# Altium schematic sheet 2.Main_V2.4.SchDoc
size 431 x 304 mm
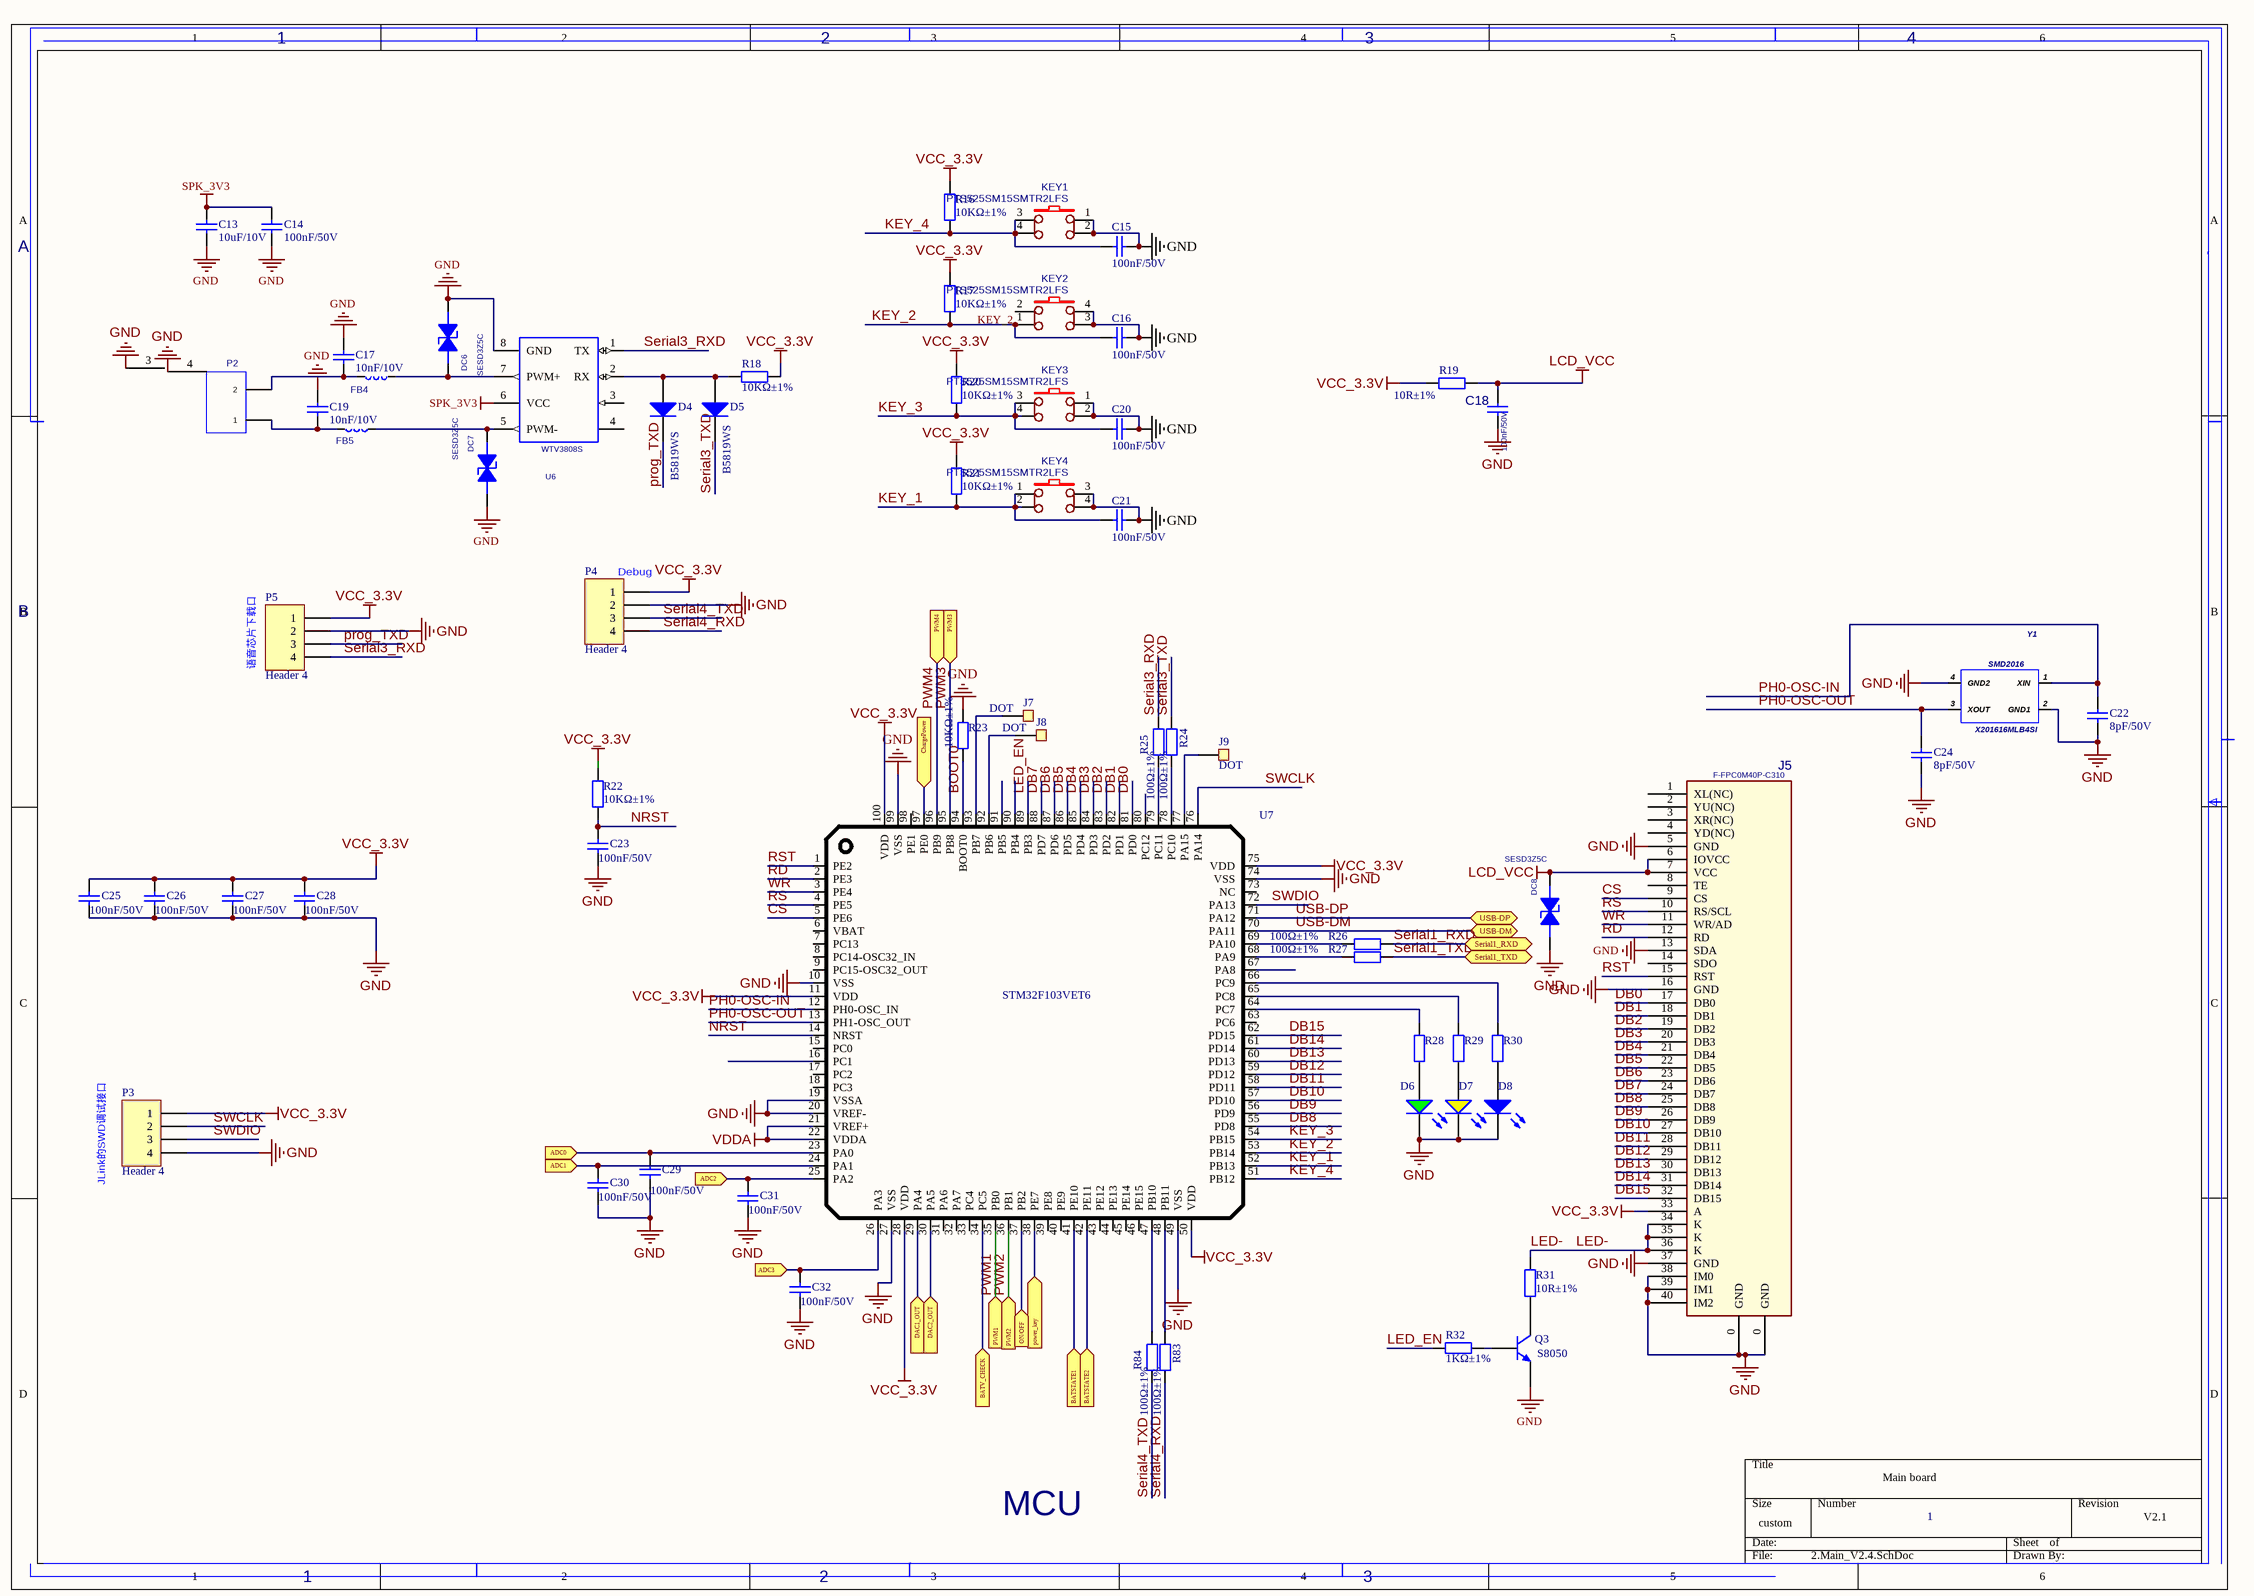
[diagram p0: 2.Main_V2.4.SchDoc]

## Parts
C13  10uF/10V  [0603C]
C14  100nF/50V  [0603C]
C15  100nF/50V  [0603C]
C16  100nF/50V  [0603C]
C17  10nF/10V  [0603C]
C18  100nF/50V  [0603C]
C19  10nF/10V  [0603C]
C20  100nF/50V  [0603C]
C21  100nF/50V  [0603C]
C22  8pF/50V  [0603C]
C23  100nF/50V  [0603C]
C24  8pF/50V  [0603C]
C25  100nF/50V  [0603C]
C26  100nF/50V  [0603C]
C27  100nF/50V  [0603C]
C28  100nF/50V  [0603C]
C29  100nF/50V  [0603C]
C30  100nF/50V  [0603C]
C31  100nF/50V  [0603C]
C32  100nF/50V  [0603C]
D4  B5819WS  [SOD-323]
D5  B5819WS  [SOD-323]
D6  19-217/GHC-YR1S2/3T  [0603_LED_S1]  (value not drawn)
D7  19-213/Y2C-CQ2R2L/3T(CY)  [0603_LED_S1]  (value not drawn)
D8  19-217/GHC-YR1S2/3T  [0603_LED_S1]  (value not drawn)
DC6  SESD3Z5C  [SOD323]
DC7  SESD3Z5C  [SOD323]
DC8  SESD3Z5C  [SOD323]
FB4  BLM18AG601SN1D  [R0603]  (value not drawn)
FB5  BLM18AG601SN1D  [R0603]  (value not drawn)
J5  F-FPC0M40P-C310  [FPC0.5 2H-WS-40P]
J7  DOT  [TP100MH]
J8  DOT  [TP100MH]
J9  DOT  [TP100MH]
KEY1  PTS525SM15SMTR2LFS  [KEY_KSC221JLFS]
KEY2  PTS525SM15SMTR2LFS  [KEY_KSC221JLFS]
KEY3  PTS525SM15SMTR2LFS  [KEY_KSC221JLFS]
KEY4  PTS525SM15SMTR2LFS  [KEY_KSC221JLFS]
P2  HX 1.25-2P WT  [1.25-2P]  (value not drawn)
P3  Header 4  [HDR1X4]
P4  Header 4  [HDR1X4]
P5  Header 4  [HDR1X4]
Q3  S8050  [SOT-23]
R16  10KΩ±1%  [0603R]
R17  10KΩ±1%  [0603R]
R18  10KΩ±1%  [0603R]
R19  10R±1%  [0603R]
R20  10KΩ±1%  [0603R]
R21  10KΩ±1%  [0603R]
R22  10KΩ±1%  [0603R]
R23  10KΩ±1%  [0603R]
R24  100Ω±1%  [0603R]
R25  100Ω±1%  [0603R]
R26  100Ω±1%  [0603R]
R27  100Ω±1%  [0603R]
R28  1.5KΩ±1%  [0603R]  (value not drawn)
R29  1.5KΩ±1%  [0603R]  (value not drawn)
R30  1.5KΩ±1%  [0603R]  (value not drawn)
R31  10R±1%  [0805_R]
R32  1KΩ±1%  [0603R]
R83  100Ω±1%  [0603R]
R84  100Ω±1%  [0603R]
U6  WTV3808S  [SOP-8_150mil]
U7  STM32F103VET6  [LQFP-100_14x14x05P]
Y1  X201616MLB4SI  PCB DECAL: SMD2016  [SMD_2016]

## Ports
ADC0 (in), ADC1 (in), ADC2 (in), ADC3 (in), BATSTATE1 (in), BATSTATE2 (in), BATV_CHECK (in), ChargePower (in), DAC1_OUT (in), DAC2_OUT (in), ON/OFF (in), power_key (in), PWM1 (in), PWM2 (in), PWM3 (in), PWM4 (in), Serial1_RXD (bidir), Serial1_TXD (bidir), USB-DM (bidir), USB-DP (bidir)

## Nets
GND: C13.2 C14.1 C15.1 C16.1 C17.1 C18.2 C19.1 C20.1 C21.1 C22.1 C23.1 C24.1 C25.1 C26.1 C27.1 C28.1 C29.1 C30.1 C31.1 C32.1 D6.K D7.K D8.K DC6.1(ANODE) DC7.1(ANODE) DC8.1(ANODE) J5.0(GND) J5.5(GND) J5.13(SDA) J5.16(GND) J5.37(GND) J5.38(IM0) J5.39(IM1) J5.40(IM2) KEY1.1 KEY1.2 KEY2.3 KEY2.4 KEY3.1 KEY3.2 KEY4.3 KEY4.4 P2.3 P2.4 P3.4 P4.2 P5.2 Q3.2(E) R23.1 U6.8(GND) U7.10(VSS) U7.19(VSSA) U7.20(VREF-) U7.27(VSS) U7.49(VSS) U7.74(VSS) U7.99(VSS) Y1.2(GND1) Y1.4(GND2)
LCD_VCC: C18.1 DC8.2(CATHODE) J5.6(IOVCC) J5.7(VCC) R19.1
SPK_3V3: C13.1 C14.2 U6.6(VCC)
VCC_3.3V: C25.2 C26.2 C27.2 C28.2 J5.33(A) P3.1 P4.1 P5.1 R16.2 R17.2 R18.1 R19.2 R20.2 R21.2 R22.2 U7.11(VDD) U7.28(VDD) U7.50(VDD) U7.75(VDD) U7.100(VDD)
VDDA: U7.21(VREF+) U7.22(VDDA)
ADC0: C29.2 U7.23(PA0) ; port ADC0
ADC1: C30.2 U7.24(PA1) ; port ADC1
ADC2: C31.2 U7.25(PA2) ; port ADC2
ADC3: C32.2 U7.26(PA3) ; port ADC3
BATSTATE1: U7.41(PE10) ; port BATSTATE1
BATSTATE2: U7.42(PE11) ; port BATSTATE2
BATV_CHECK: U7.34(PC5) ; port BATV_CHECK
BOOT0: R23.2 U7.94(BOOT0)
ChargePower: U7.97(PE0) ; port ChargePower
CS: J5.9(CS) U7.5(PE6)
DAC1_OUT: U7.29(PA4) ; port DAC1_OUT
DAC2_OUT: U7.30(PA5) ; port DAC2_OUT
DB0: J5.17(DB0) U7.81(PD0)
DB1: J5.18(DB1) U7.82(PD1)
DB2: J5.19(DB2) U7.83(PD2)
DB3: J5.20(DB3) U7.84(PD3)
DB4: J5.21(DB4) U7.85(PD4)
DB5: J5.22(DB5) U7.86(PD5)
DB6: J5.23(DB6) U7.87(PD6)
DB7: J5.24(DB7) U7.88(PD7)
DB8: J5.25(DB8) U7.55(PD8)
DB9: J5.26(DB9) U7.56(PD9)
DB10: J5.27(DB10) U7.57(PD10)
DB11: J5.28(DB11) U7.58(PD11)
DB12: J5.29(DB12) U7.59(PD12)
DB13: J5.30(DB13) U7.60(PD13)
DB14: J5.31(DB14) U7.61(PD14)
DB15: J5.32(DB15) U7.62(PD15)
KEY_1: C21.2 KEY4.1 KEY4.2 R21.1 U7.52(PB13)
KEY_2: C16.2 KEY2.1 KEY2.2 R17.1 U7.53(PB14)
KEY_3: C20.2 KEY3.3 KEY3.4 R20.1 U7.54(PB15)
KEY_4: C15.2 KEY1.3 KEY1.4 R16.1 U7.51(PB12)
LED-: J5.34(K) J5.35(K) J5.36(K) R31.2
LED_EN: R32.2 U7.89(PB3)
NRST: C23.2 R22.1 U7.14(NRST)
ON/OFF: U7.37(PB2) ; port ON/OFF
PH0-OSC-IN: C22.2 U7.12(PH0-OSC_IN) Y1.1(XIN)
PH0-OSC-OUT: C24.2 U7.13(PH1-OSC_OUT) Y1.3(XOUT)
power_key: U7.38(PE7) ; port power_key
prog_TXD: D4.2(K) P5.3
PWM1: U7.35(PB0) ; port PWM1
PWM2: U7.36(PB1) ; port PWM2
PWM3: U7.95(PB8) ; port PWM3
PWM4: U7.96(PB9) ; port PWM4
RD: J5.12(RD) U7.2(PE3)
RS: J5.10(RS/SCL) U7.4(PE5)
RST: J5.15(RST) U7.1(PE2)
Serial1_RXD: R26.1 ; port Serial1_RXD
Serial1_TXD: R27.1 ; port Serial1_TXD
Serial3_RXD: P5.4 R25.1 U6.1(TX)
Serial3_TXD: D5.2(K) R24.1
Serial4_RXD: P4.4 R83.2
Serial4_TXD: P4.3 R84.2
SWCLK: P3.2 U7.76(PA14)
SWDIO: P3.3 U7.72(PA13)
USB-DM: U7.70(PA11) ; port USB-DM
USB-DP: U7.71(PA12) ; port USB-DP
WR: J5.11(WR/AD) U7.3(PE4)
NetC17_2: C17.2 FB4.1 P2.2
NetC19_2: C19.2 FB5.1 P2.1
NetD4_1: D4.1(A) D5.1(A) R18.2 U6.2(RX)
NetD6_A: D6.A R28.1
NetD7_A: D7.A R29.1
NetD8_A: D8.A R30.1
NetDC6_2: DC6.2(CATHODE) FB4.2 U6.7(PWM+)
NetDC7_2: DC7.2(CATHODE) FB5.2 U6.5(PWM-)
NetJ7_1: J7.1 U7.93(PB7)
NetJ8_1: J8.1 U7.92(PB6)
NetJ9_1: J9.1 U7.77(PA15)
NetQ3_1: Q3.1(B) R32.1
NetQ3_3: Q3.3(C) R31.1
NetR24_2: R24.2 U7.78(PC10)
NetR25_2: R25.2 U7.79(PC11)
NetR26_2: R26.2 U7.69(PA10)
NetR27_2: R27.2 U7.68(PA9)
NetR28_2: R28.2 U7.64(PC7)
NetR29_2: R29.2 U7.65(PC8)
NetR30_2: R30.2 U7.66(PC9)
NetR83_1: R83.1 U7.48(PB11)
NetR84_1: R84.1 U7.47(PB10)

Not connected (* = marked no-connect by the designer): J5 1(XL(NC)) 2(YU(NC)) 3(XR(NC)) 4(YD(NC)) 8(TE) 14(SDO); U6 3(IN+) 4(IN-); U7 6(VBAT) 7(PC13) 8(PC14-OSC32_IN) 9(PC15-OSC32_OUT) 15(PC0) 16(PC1) 17(PC2) 18(PC3) 31(PA6) 32(PA7) 33(PC4) 39(PE8) 40(PE9) 43(PE12) 44(PE13) 45(PE14) 46(PE15) 63(PC6) 67(PA8) 73(NC) 80(PC12) 90(PB4) 91(PB5) 98(PE1)

## Notes on the sheet
- 1
- 2
- 3
- 4
- A
- (near P4) Debug
- B
- (near P5) 语音芯片下载口
- JLink的SWD调试接口
- Main board
- MCU
- V2.1

## Library data of the parts
C13 = Cap: Capacitor; Value: 100pF; Published: 8-Jun-2000; LatestRevisionDate: 17-Jul-2002; LatestRevisionNote: Re-released for DXP Platform.; PackageReference: RAD-0.3; Publisher: Altium Limited; PackageDescription: Radial Cap, Thru-Hole; 2 Leads; 0.3 in Pin Spacing
C14 = Cap: Capacitor 100nF/50V; Value: 100pF; Published: 8-Jun-2000; LatestRevisionDate: 17-Jul-2002; LatestRevisionNote: Re-released for DXP Platform.; PackageReference: RAD-0.3; Publisher: Altium Limited; PackageDescription: Radial Cap, Thru-Hole; 2 Leads; 0.3 in Pin Spacing
C15 C16 C20 C21 C23 C25-C32 = 0402 100nF (104) 10% 16V: 贴片电容100nF 10% 50V; ComponentLink1Description: 供应商链接; ComponentLink1URL: http://www.szlcsc.com/product/details_1877.html; Package: 0402; Supplier: LC; SuppliersPartNumber: C1525
C17 C19 = 0402 10nF (103) 10% 50V: 贴片电容; ComponentLink1Description: 供应商链接; ComponentLink1URL: http://www.szlcsc.com/product/details_15869.html; Package: 0402; Supplier: LC; SuppliersPartNumber: C15195
C18 = CAP103: PCB DECAL: C0603AA; Value: 0.1uF
C22 C24 = 0402 6.8pF (6R8) 0.25pF 50V: 贴片电容; ComponentLink1Description: 供应商链接; ComponentLink1URL: http://www.szlcsc.com/product/details_1928.html; Package: 0402; Supplier: LC; SuppliersPartNumber: C1576
D4 D5 = Diode: CJ(江苏长电/长晶); Published: 8-Jun-2000; LatestRevisionDate: 17-Jul-2002; LatestRevisionNote: Re-released for DXP Platform.; PackageVersion: Sep-1996; PackageReference: SMC; Publisher: Altium Limited; PackageDescription: DO-214-AB/SMC; 2 C-Bend Leads; Body 7.9 x 5.9 mm, inc. leads (LxW); Code_JEDEC: DO-214-AB
D6 = 0603 绿灯: 发光二极管 EVERLIGHT(亿光) 0603 翠绿; ComponentLink1Description: 供应商链接; ComponentLink1URL: http://www.szlcsc.com/product/details_73152.html; Package: 0603; Supplier: LC; SuppliersPartNumber: C72043
D7 = 0603 黄灯: 发光二极管  0603 黄灯; ComponentLink1Description: 供应商链接; ComponentLink1URL: http://www.szlcsc.com/product/details_73147.html; Package: 0603; Supplier: LC; SuppliersPartNumber: C72038
D8 = 0603 蓝灯: 发光二极管 EVERLIGHT(亿光) 0603 蓝灯; ComponentLink1Description: 供应商链接; ComponentLink1URL: http://www.szlcsc.com/product/details_73150.html; Package: 0603; Supplier: LC; SuppliersPartNumber: C72041
DC6-DC8 = ESD5451X_Dup1: ID: DE-E0004; Parameter: ESD0402
FB4 FB5 = ZXC: 磁珠/600Ω@100MHz ±25% BLM18AG601SN1D 0603; Value: 200R/1A; PCB DECAL: R0603
J5 = FPC_40_LVDS: ROOM: MIPI
KEY1-KEY4 = button6*6*8.5: BOM_Manufacturer: ReliaPro; BOM_Supplier Part: C59980; BOM_Supplier: LCSC; BOM_Manufacturer Part: button6*6*8.5; image: http://image.lceda.cn/szlcsc/C59980.jpg; spicePre: K; spiceSymbolName: button6*6*8.5
P2 = DIP-2.0-2P: SHOU HAN(首韩) 间距：1.25mm 插针结构：1x2P 排数：1 每排PIN数：2 间距：1.25mm; PCB DECAL: DIP-2.54-2P; LatestRevisionDate: 17-Jul-2002; LatestRevisionNote: Re-released for DXP Platform.; Publisher: Altium Limited
P3-P5 = Header 4: Header, 4-Pin; LatestRevisionDate: 17-Jul-2002; LatestRevisionNote: Re-released for DXP Platform.; Publisher: Altium Limited
Q3 = SOT-23 SS8050 Y1: 三极管; ComponentLink1Description: 供应商链接; ComponentLink1URL: http://www.szlcsc.com/product/details_2507.html; Package: SOT-23; Supplier: LC; SuppliersPartNumber: C2150
R16-R18 R20-R23 = 0402 10KΩ (1002) 1%: 贴片电阻; ComponentLink1Description: 供应商链接; ComponentLink1URL: http://www.szlcsc.com/product/details_26487.html; Package: 0402; Supplier: LC; SuppliersPartNumber: C25744
R19 R31 = 0603 10Ω (10R0) 1%: 贴片电阻; ComponentLink1Description: 供应商链接; ComponentLink1URL: http://www.szlcsc.com/product/details_23586.html; Package: 0603; Supplier: LC; SuppliersPartNumber: C22859
R24-R27 R83 R84 = 0603 100Ω (1000) 1%: 贴片电阻; ComponentLink1Description: 供应商链接; ComponentLink1URL: http://www.szlcsc.com/product/details_23502.html; Package: 0603; Supplier: LC; SuppliersPartNumber: C22775
R28-R30 = 0603 1.5KΩ (1501) 1%: 贴片电阻; ComponentLink1Description: 供应商链接; ComponentLink1URL: http://www.szlcsc.com/product/details_23570.html; Package: 0603; Supplier: LC; SuppliersPartNumber: C22843
R32 = 0603 1KΩ (1001) 1%: 贴片电阻; ComponentLink1Description: 供应商链接; ComponentLink1URL: http://www.szlcsc.com/product/details_21904.html; Package: 0603; Supplier: LC; SuppliersPartNumber: C21190
U6 = WTVXXX8S: WTV3808S  380; Manufacturer_Part_Number: OPA335AIDBVR; Mfr_Name: Texas Instruments; Copyright: Copyright (C) 2022 Ultra Librarian. All rights reserved.
U7 = STM32F407VETx
Y1 = CRYSTAL_4P: YXC(扬兴晶振) X201616MLB4SI  16MHz 频率公差：±10ppm; Manufacturer_PN: E3SB25.0000F10E11; Manufacturer: Hosonic(鸿星电子); Part_Type: X322525MSB4SI; Created_by: JJJ; Priority: A; Source_Path: Z:\RK_STANDARD_LIBRARY\CADENCE_CIS\RK_DISCRETE.OLB; RK_PN: E3SB25.0000F10E11